# EAGLE design CAN-BUS Shield  v2.0 (EAGLE 6.4)
DESCRIPTION: microOBD 200 OBD-II Module; HW_REV: 1.4; PCB_REV: C; PCB_SPEC1: Layer Count: 4; PCB_SPEC2: Size: 1.3" x 0.59"; PCB_SPEC3: Finish Thickness: 0.049" - 0.052"; PCB_SPEC4: Copper Weight: 1oz; TITLE: STM1120

## Sheet 1 of 2
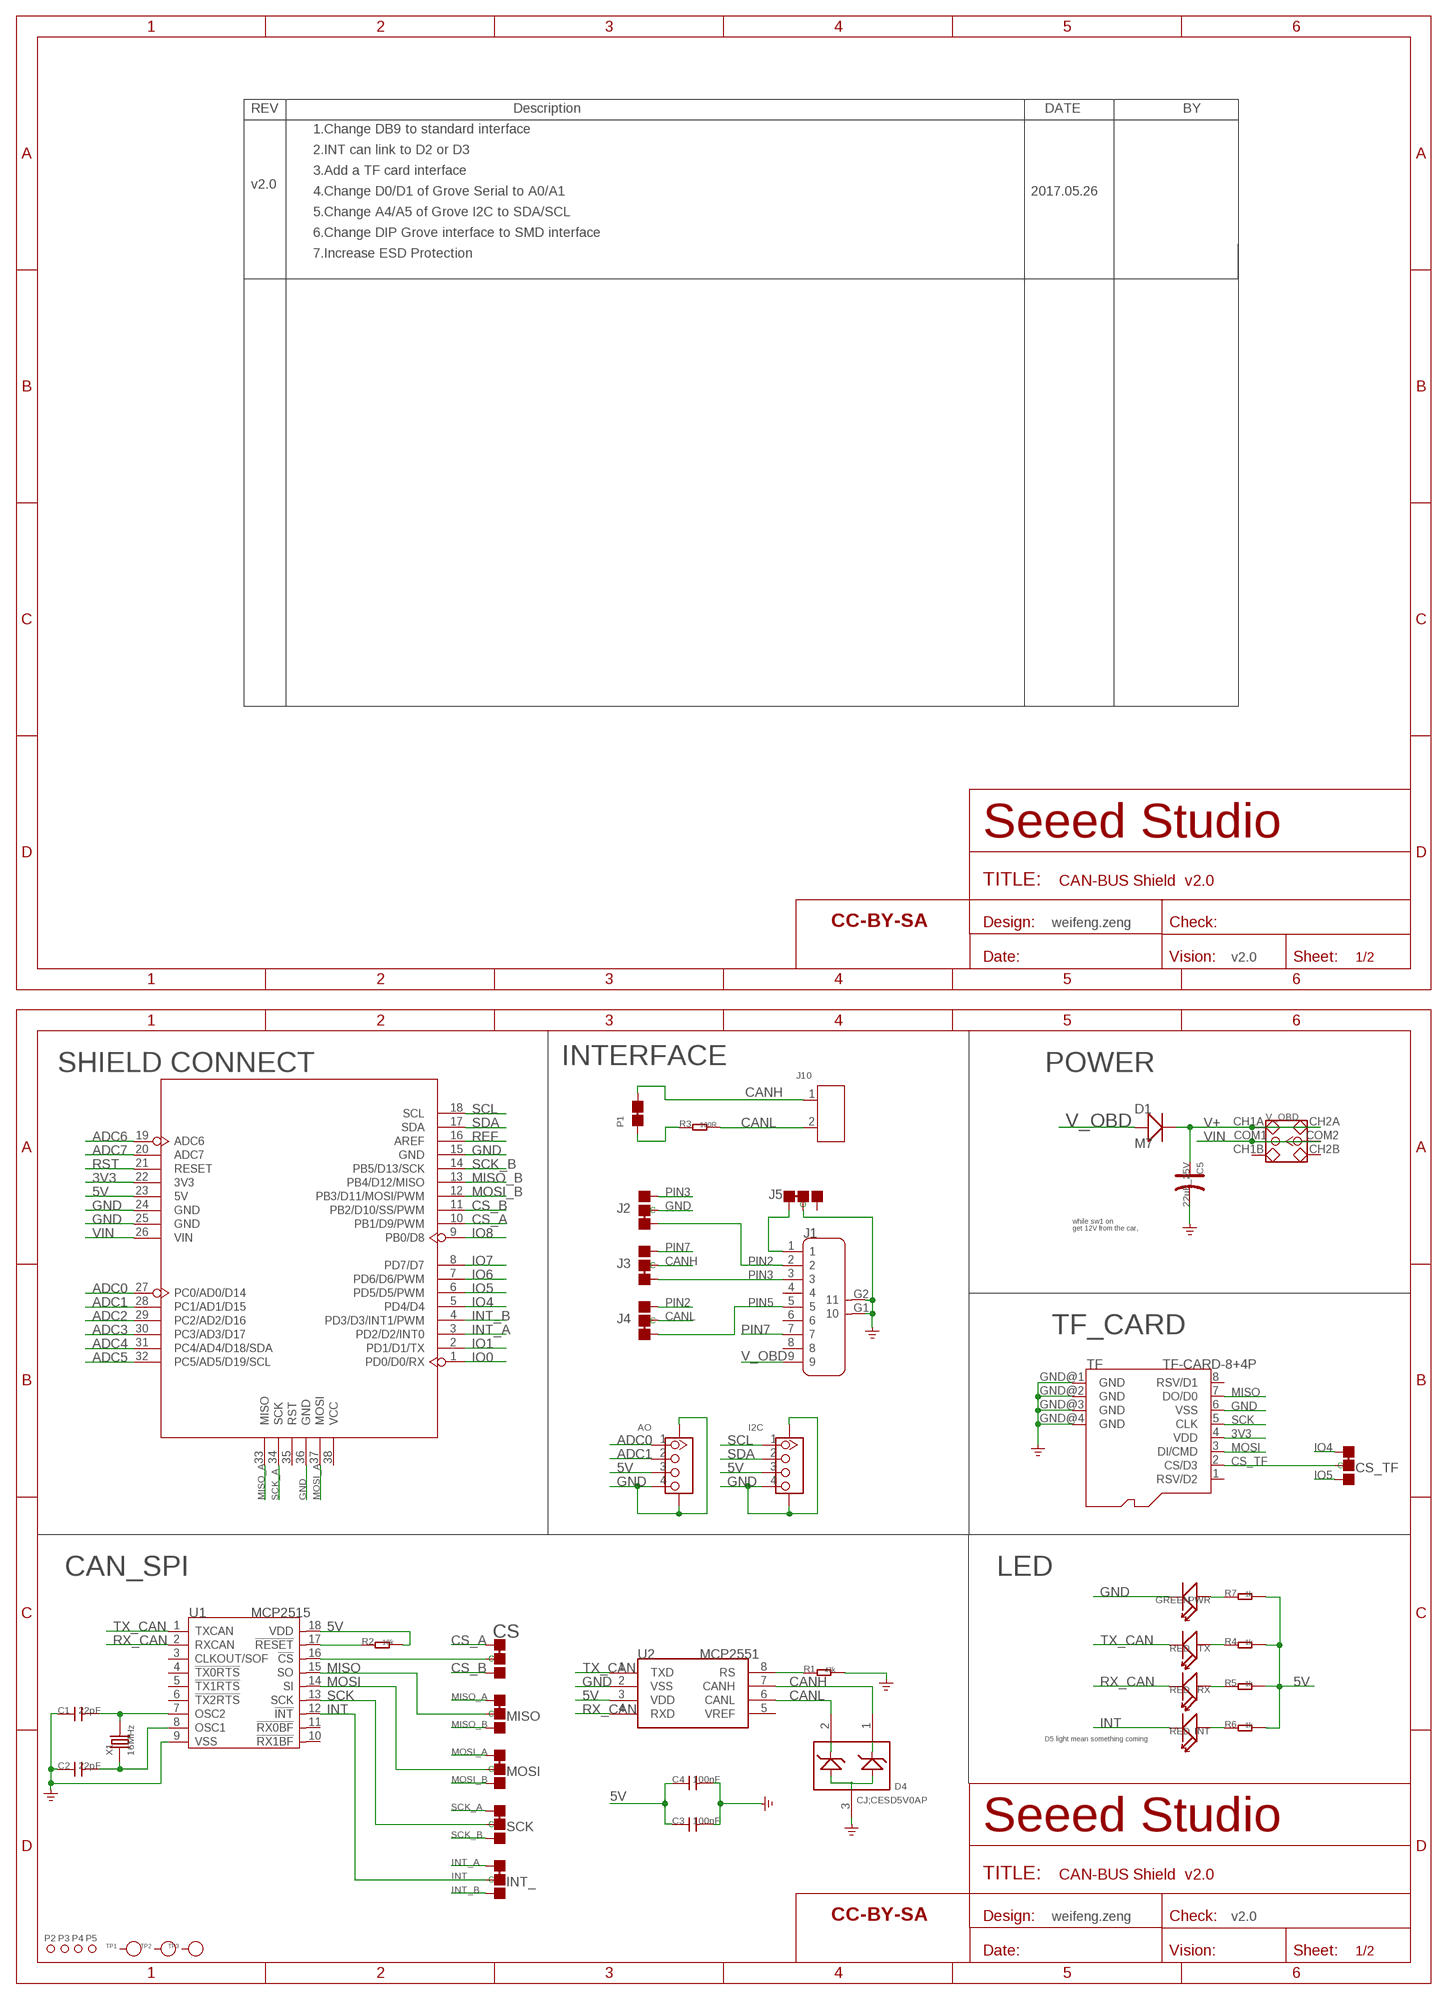
[diagram p0: schematic, sheet 1]

### Parts
AO  GROVE-CONNECTOR-SMD'90D'  [HW4-SMD-2.0-90D]
C1  22pF  C-0603  [0603]
C2  22pF  C-0603  [0603]
C3  100nF  C-0603  [0603]
C4  100nF  C-0603  [0603]
C5  22uF_25V  CAP-ELECTRO-B  [ELECTRO-SMD-B-4.8MM]
CS  JUMPER-3P-SHORT  [3P-SMD-SHORT]
CS_TF  JUMPER-3P-SHORT  [3P-SMD-SHORT]
D1  M7  D-SMA  [D2010]
D4  CJ;CESD5V0AP  D-ESD-3P'CESD3V3AP'  [SOT-23]
I2C  GROVE-CONNECTOR-SMD'90D'  [HW4-SMD-2.0-90D]
INT  RED  LED'0603'  [LED-0603]
INT_  JUMPER-3P-SHORT  [3P-SMD-SHORT]
J1  DB9'MEAL'  [DB9-MEAL]
J2  JUMPER-3P-SHORT  [3P-SMD-SHORT]
J3  JUMPER-3P-SHORT  [3P-SMD-SHORT]
J4  JUMPER-3P-SHORT  [3P-SMD-SHORT]
J5  JUMPER-3P-SHORT  [3P-SMD-SHORT]
J10  SCREW-TERMINAL-2P-10.6X10  [H2-5.0-10.6X10X14.8H]
MISO  JUMPER-3P-SHORT  [3P-SMD-SHORT]
MOSI  JUMPER-3P-SHORT  [3P-SMD-SHORT]
P1  JUMPER-2P-SHORT  [2P-SMD-SHORT]
P2  PAD-MARK'ANNULAR'  [ROUND-MARK-1.0]
P3  PAD-MARK'ANNULAR'  [ROUND-MARK-1.0]
P4  PAD-MARK'ANNULAR'  [ROUND-MARK-1.0]
P5  PAD-MARK'ANNULAR'  [ROUND-MARK-1.0]
PWR  GREEN  LED'0603'  [LED-0603]
R1  47k  R-0603  [0603]
R2  10k  R-0603  [0603]
R3  120R  R-0603  [0603]
R4  1k  R-0603  [0603]
R5  1k  R-0603  [0603]
R6  1k  R-0603  [0603]
R7  1k  R-0603  [0603]
RX  RED  LED'0603'  [LED-0603]
SCK  JUMPER-3P-SHORT  [3P-SMD-SHORT]
TF  TF-CARD-8+4P  [TF-8+4P-1.1-13.5X15MM]
TP1  PAD-TEST-POINT'4545'  [TP_4545]
TP2  PAD-TEST-POINT'4545'  [TP_4545]
TP3  PAD-TEST-POINT'4545'  [TP_4545]
TX  RED  LED'0603'  [LED-0603]
U1  MCP2515  MCP2515-SOIC18  [SOIC18]
U2  MCP2551  MCP2551-SOIC8  [SOIC8-6.0]
U4  ARDUINO-38P'WITH/-SILK'  [ARDUINO-38P-WITH/-SILK-500519002]
U$5  SEEEDSTUDIO-OPEN-SCH-FRAME  [SEEEDSTUDIO-PCB-FRAME]
U$7  SEEEDSTUDIO-OPEN-SCH-FRAME  [SEEEDSTUDIO-PCB-FRAME]
V_OBD  SWITCH-2CH-6P  [6P-2CH-2.54-7.6X3.0]
X1  16MHz  CRYSTAL-HC49S  [HC49/S]

### Nets
3V3: TF.4(VDD) U4.22(3V3)
5V: AO.3 C3.1 C4.1 I2C.3 R2.2 R4.2 R5.2 R6.2 R7.2 U1.18(VDD) U2.3(VDD) U4.23(5V)
ADC0: AO.1 U4.27(PC0/AD0/D14)
ADC1: AO.2 U4.28(PC1/AD1/D15)
ADC2: U4.29(PC2/AD2/D16)
ADC3: U4.30(PC3/AD3/D17)
ADC4: U4.31(PC4/AD4/D18/SDA)
ADC5: U4.32(PC5/AD5/D19/SCL)
ADC6: U4.19(ADC6)
ADC7: U4.20(ADC7)
CANH: D4.1 J3.MM(C) J10.1 P1.2 U2.7(CANH)
CANL: D4.2 J4.MM(C) J10.2 R3.2 U2.6(CANL)
CS_A: CS.11(L) U4.10(PB1/D9/PWM)
CS_B: CS.00(R) U4.11(PB2/D10/SS/PWM)
CS_TF: CS_TF.MM(C) TF.2(CS/D3)
GND: AO.4 AO.SS1 AO.SS2 C1.1 C2.1 C3.2 C4.2 C5.- D4.3 I2C.4 I2C.SS1 I2C.SS2 J1.G1 J1.G2 J2.MM(C) J5.MM(C) PWR.- R1.2 TF.6(VSS) TF.GND@1(GND) TF.GND@2(GND) TF.GND@3(GND) TF.GND@4(GND) U1.9(VSS) U2.2(VSS) U4.15(GND) U4.24(GND) U4.25(GND) U4.36(GND) ; supply symbol labelled GND_POWER
INT: INT.- INT_.MM(C) U1.12(!INT)
INT_A: INT_.11(L) U4.3(PD2/D2/INT0)
INT_B: INT_.00(R) U4.4(PD3/D3/INT1/PWM)
IO0: U4.1(PD0/D0/RX)
IO1: U4.2(PD1/D1/TX)
IO4: CS_TF.11(L) U4.5(PD4/D4)
IO5: CS_TF.00(R) U4.6(PD5/D5/PWM)
IO6: U4.7(PD6/D6/PWM)
IO7: U4.8(PD7/D7)
IO8: U4.9(PB0/D8)
MISO: MISO.MM(C) TF.7(DO/D0) U1.15(SO)
MISO_A: MISO.11(L) U4.33(MISO)
MISO_B: MISO.00(R) U4.13(PB4/D12/MISO)
MOSI: MOSI.MM(C) TF.3(DI/CMD) U1.14(SI)
MOSI_A: MOSI.11(L) U4.37(MOSI)
MOSI_B: MOSI.00(R) U4.12(PB3/D11/MOSI/PWM)
N$1: PWR.+ R7.1
N$2: R4.1 TX.+
N$3: P1.1 R3.1
N$4: J1.1 J5.11(L)
N$13: CS.MM(C) U1.16(!CS)
N$15: R5.1 RX.+
N$16: C1.2 U1.7(OSC2) X1.2
N$17: C2.2 U1.8(OSC1) X1.1
N$19: INT.+ R6.1
N$20: R1.1 U2.8(RS)
PIN2: J1.2 J2.11(L) J4.00(R)
PIN3: J1.3 J2.00(R) J3.11(L)
PIN5: J1.5 J4.11(L)
PIN7: J1.7 J3.00(R)
REF: U4.16(AREF)
RST: U4.21(RESET)
RST_N: R2.1 U1.17(!RESET)
RX_CAN: RX.- U1.2(RXCAN) U2.4(RXD)
SCK: SCK.MM(C) TF.5(CLK) U1.13(SCK)
SCK_A: SCK.11(L) U4.34(SCK)
SCK_B: SCK.00(R) U4.14(PB5/D13/SCK)
SCL: I2C.1 U4.18(SCL)
SDA: I2C.2 U4.17(SDA)
TX_CAN: TX.- U1.1(TXCAN) U2.1(TXD)
V+: C5.+ D1.- V_OBD.CH1A V_OBD.CH2A
V_OBD: D1.+ J1.9
VIN: U4.26(VIN) V_OBD.COM1 V_OBD.COM2
Unconnected: J1.4 J1.6 J1.8 J5.00(R) TF.1(RSV/D2) TF.8(RSV/D1) TP1.T TP2.T TP3.T U1.3(CLKOUT/SOF) U1.4(!TX0RTS) U1.5(!TX1RTS) U1.6(!TX2RTS) U1.10(!RX1BF) U1.11(!RX0BF) U2.5(VREF) U4.35(RST) U4.38(VCC) V_OBD.CH1B V_OBD.CH2B

### Notes on the sheet
- 1.Change DB9 to standard interface
- 2.INT can link to D2 or D3
- 3.Add a TF card interface
- v2.0
- 4.Change D0/D1 of Grove Serial to A0/A1 | 2017.05.26
- 5.Change A4/A5 of Grove I2C to SDA/SCL
- 6.Change DIP Grove interface to SMD interface
- 7.Increase ESD Protection
- weifeng.zeng
- v2.0
- SHIELD CONNECT | INTERFACE | POWER
- while sw1 on
- get 12V from the car,
- TF_CARD
- CAN_SPI | LED
- D5 light mean something coming
- weifeng.zeng | v2.0

## Sheet 2 of 2

## Library data of the parts
AO I2C = Connector-new:GROVE-CONNECTOR-SMD: 4P-SMD-2.0:320110030;4P-SMD-2.0-90D:320110032
C1-C4 = Discrete:C*: Ceramic Capacitors
C5 = Discrete:CAP*: Electrolytic Capacitors,Tantalum Capacitors and Super Capacitors
CS CS_TF INT_ J2-J5 MISO MOSI SCK = Discrete-new:JUMPER-3P-SHORT
D1 = Discrete:D*
D4 = Discrete-new:D-ESD-3P: 304060003
INT PWR RX TX = Discrete:LED*
J1 = Connector:DB9
J10 = Connector-new:SCREW-TERMINAL-2P: 2P-3.5:320110028;2P-5.0:320110031
P1 = Discrete-new:JUMPER-2P-SHORT
P2-P5 = Discrete-new:PAD-MARK; PARTNO: DNP
R1-R7 = Discrete:R*
TF = Connector-new:TF-CARD-8+4P: http://garden.seeedstudio.com/images/e/e4/Flip_TF_Holder.jpg
TP1-TP3 = Discrete:PAD-TEST-POINT; PARTNO: DNP
U1 = IC:MCP2515: Stand-Alone CAN Controller With SPI Interface
U2 = IC:MCP2551: High-Speed CAN Transceiver http://ww1.microchip.com/downloads/en/devicedoc/21667f.pdf
U4 = moudle:ARDUINO-38P
U$5 U$7 = moudle-new:SEEEDSTUDIO-OPEN-SCH-FRAME
V_OBD = Discrete:SWITCH-2CH-6P
X1 = Discrete:CRYSTAL*: CRYSTAL

## Net classes
0 default: width 0.152 mm, drill 0.254 mm, clearance 0.152 mm

## Board
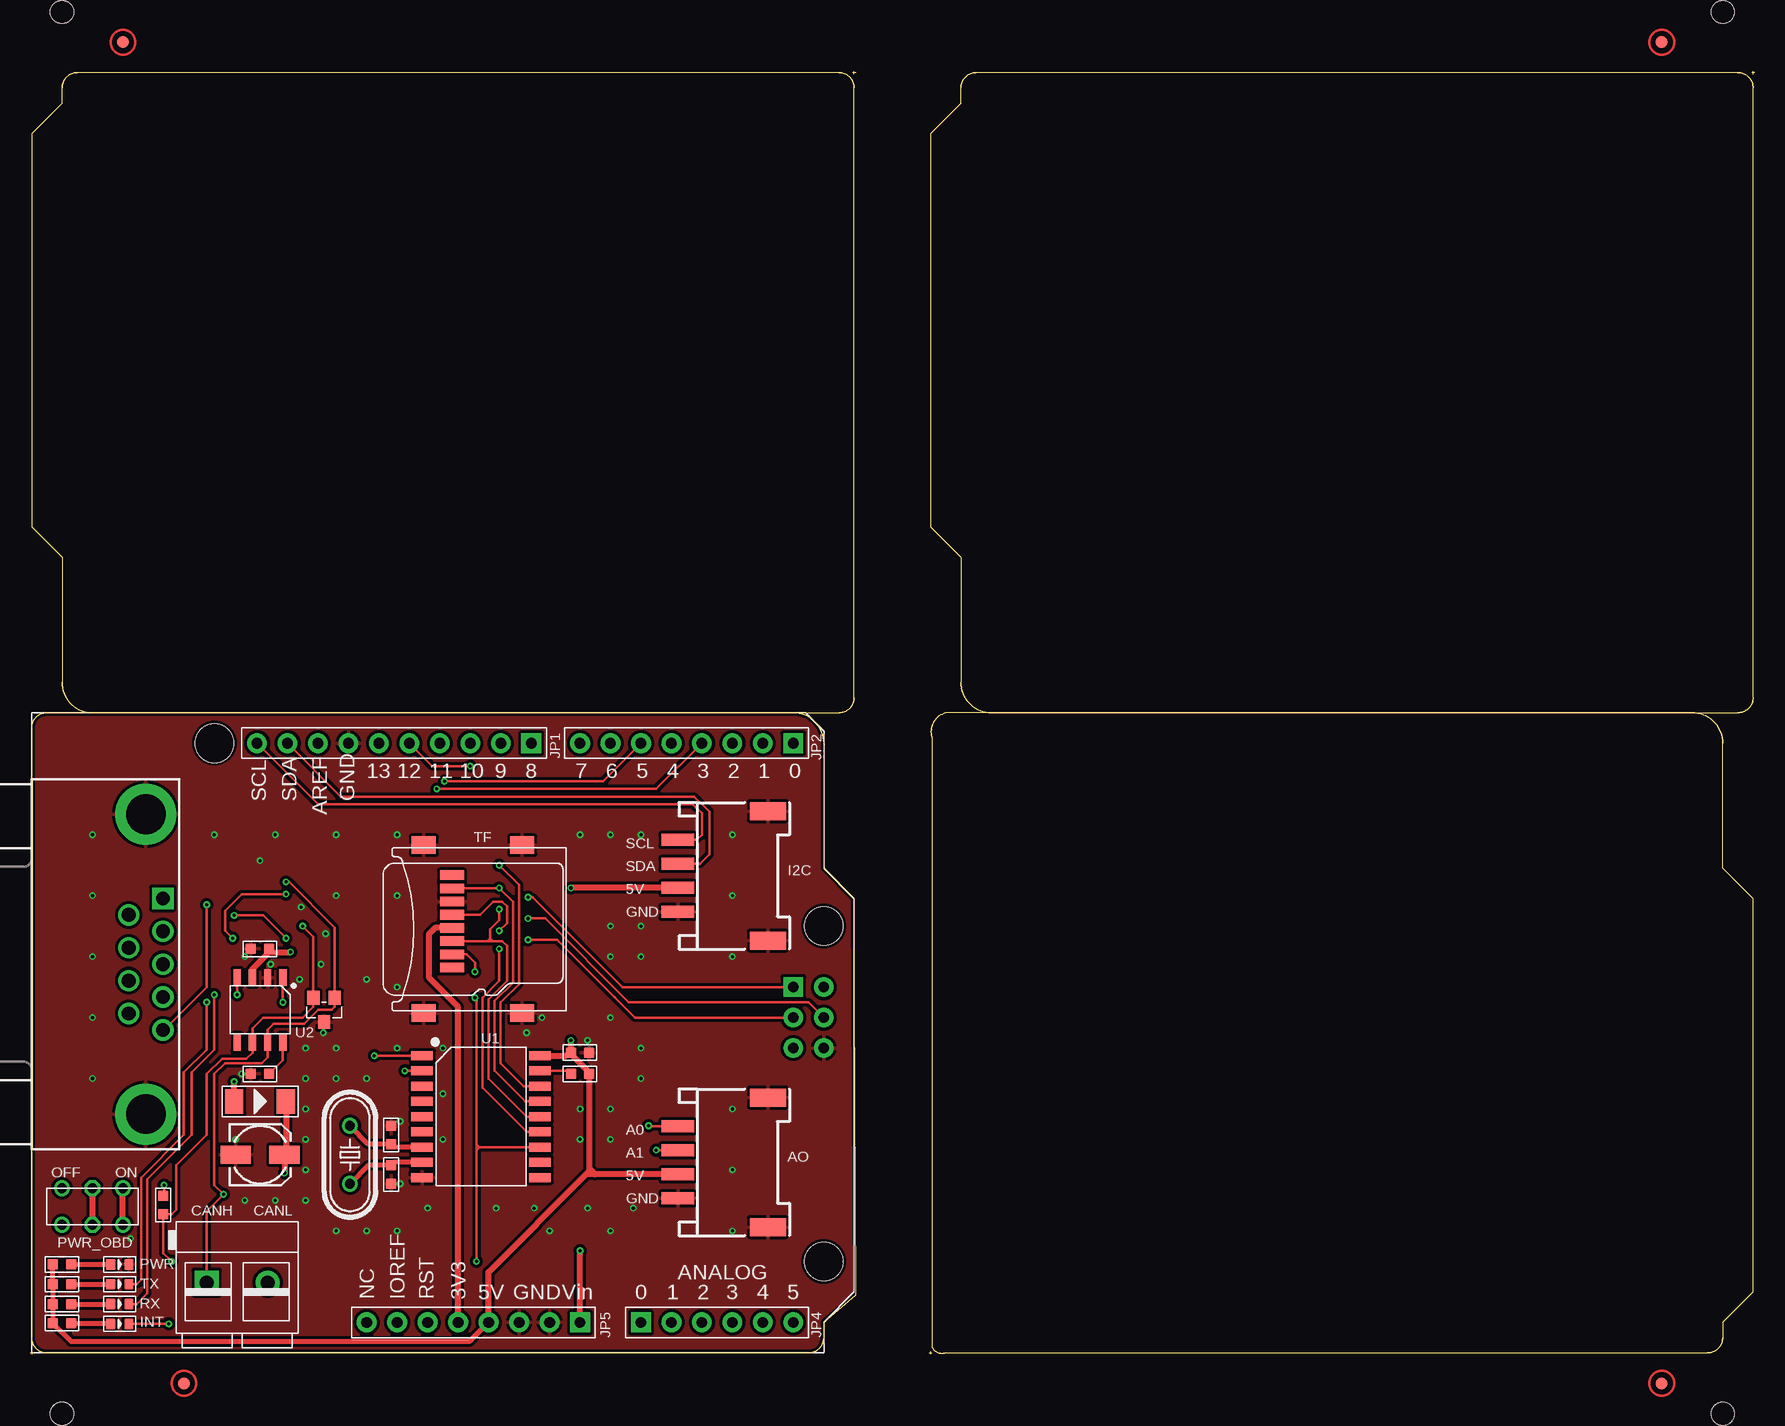
[diagram p1: board, top side]
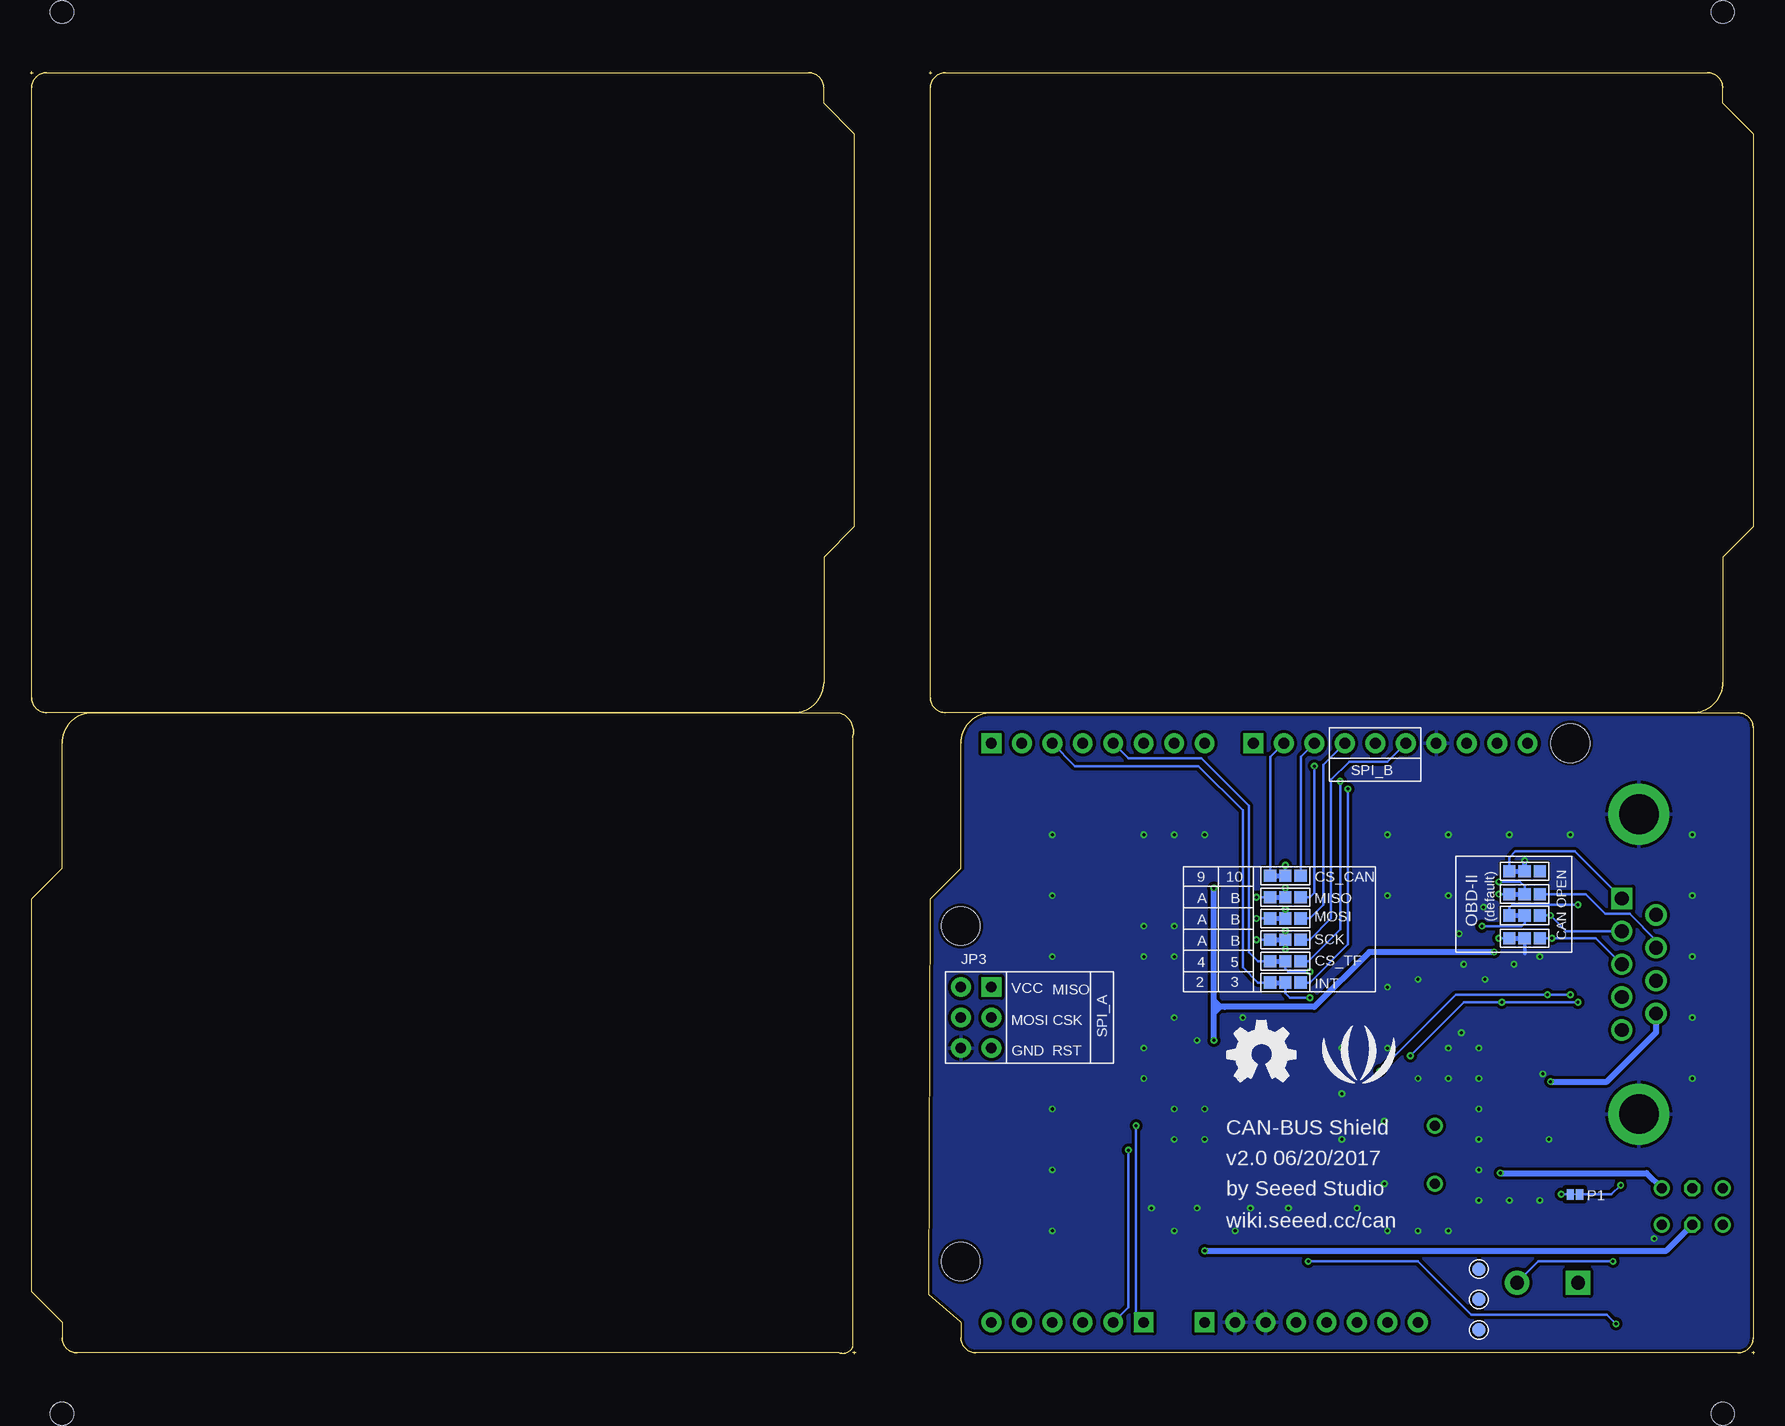
[diagram p2: board, bottom side, seen from below]

Size 143.76 x 106.93 mm. Coordinates in mm from the lower left corner, seen from the top.
Outline: 66.17,1.4 arc-90 64.9,0.13
Outline: 1.4,0.13 arc-90 0.13,1.4
Outline: 0.13,52.2 arc-90 1.4,53.47
Outline: 63.63,53.47 arc-90 66.17,50.93
Outline: 0.13,1.4 arc90 1.4,0.13
Outline: 64.9,0.13 arc90 66.17,1.4
Outline: 1.4,53.47 arc90 0.13,52.2
Outline: 0.13,1.4 arc90 1.4,0.13
Outline: 64.9,0.13 arc90 66.17,1.4
Outline: 66.17,50.93 arc90 63.63,53.47
Outline: 66.17,1.4 66.17,2.67 68.83,4.95 68.71,37.97 66.17,40.51 66.17,50.93
Outline: 66.17,1.4 arc-90 64.9,0.13
Outline: 63.63,53.47 1.4,53.47
Outline: 1.4,53.47 arc90 0.13,52.2
Outline: 0.13,52.2 0.13,1.4
Outline: 0.13,1.4 arc90 1.4,0.13
Outline: 66.17,50.93 arc90 63.63,53.47
Outline: 1.4,0.13 64.9,0.13
Outline: 0,0.13 0.25,0.13
Outline: 0.13,0.25 0.13,0
Outline: 141.1,1.4 arc-90 139.83,0.13
Outline: 76.33,0.13 arc-90 75.18,0.64
Outline: 75.18,51.44 arc-90 76.33,53.47
Outline: 138.56,53.47 arc-90 141.1,50.93
Outline: 75.18,0.64 arc90 76.33,0.13
Outline: 139.83,0.13 arc90 141.1,1.4
Outline: 76.33,53.47 arc90 75.18,51.44
Outline: 75.18,0.64 arc90 76.33,0.13
Outline: 139.83,0.13 arc90 141.1,1.4
Outline: 141.1,50.93 arc90 138.56,53.47
Outline: 141.1,1.4 141.1,2.67 143.64,5.21 143.64,37.97 141.1,40.51 141.1,50.93
Outline: 141.1,1.4 arc-90 139.83,0.13
Outline: 138.56,53.47 76.33,53.47
Outline: 76.33,53.47 arc90 75.18,51.44
Outline: 75.18,51.44 75.18,0.64
Outline: 75.18,0.64 arc90 76.33,0.13
Outline: 141.1,50.93 arc90 138.56,53.47
Outline: 76.33,0.13 139.83,0.13
Outline: 74.93,0.13 75.18,0.13
Outline: 75.06,0.25 75.06,0
Outline: 2.67,105.54 arc-90 3.94,106.81
Outline: 67.44,106.81 arc-90 68.71,105.54
Outline: 68.71,54.74 arc-90 67.44,53.47
Outline: 5.21,53.47 arc-90 2.67,56.01
Outline: 68.71,105.54 arc90 67.44,106.81
Outline: 3.94,106.81 arc90 2.67,105.54
Outline: 67.44,53.47 arc90 68.71,54.74
Outline: 68.71,105.54 arc90 67.44,106.81
Outline: 3.94,106.81 arc90 2.67,105.54
Outline: 2.67,56.01 arc90 5.21,53.47
Outline: 2.67,105.54 2.67,104.27 0.13,101.73 0.13,68.96 2.67,66.42 2.67,56.01
Outline: 2.67,105.54 arc-90 3.94,106.81
Outline: 5.21,53.47 67.44,53.47
Outline: 67.44,53.47 arc90 68.71,54.74
Outline: 68.71,54.74 68.71,105.54
Outline: 68.71,105.54 arc90 67.44,106.81
Outline: 2.67,56.01 arc90 5.21,53.47
Outline: 67.44,106.81 3.94,106.81
Outline: 68.83,106.81 68.58,106.81
Outline: 68.71,106.68 68.71,106.93
Outline: 77.6,105.54 arc-90 78.87,106.81
Outline: 142.37,106.81 arc-90 143.64,105.54
Outline: 143.64,54.74 arc-90 142.37,53.47
Outline: 80.14,53.47 arc-90 77.6,56.01
Outline: 143.64,105.54 arc90 142.37,106.81
Outline: 78.87,106.81 arc90 77.6,105.54
Outline: 142.37,53.47 arc90 143.64,54.74
Outline: 143.64,105.54 arc90 142.37,106.81
Outline: 78.87,106.81 arc90 77.6,105.54
Outline: 77.6,56.01 arc90 80.14,53.47
Outline: 77.6,105.54 77.6,104.27 75.06,101.73 75.06,68.96 77.6,66.42 77.6,56.01
Outline: 77.6,105.54 arc-90 78.87,106.81
Outline: 80.14,53.47 142.37,53.47
Outline: 142.37,53.47 arc90 143.64,54.74
Outline: 143.64,54.74 143.64,105.54
Outline: 143.64,105.54 arc90 142.37,106.81
Outline: 77.6,56.01 arc90 80.14,53.47
Outline: 142.37,106.81 78.87,106.81
Outline: 143.76,106.81 143.51,106.81
Outline: 143.64,106.68 143.64,106.93
Copper layers (1*16): Top 0.035mm / dielectric 1.5mm / Bottom 0.035mm
Design rules "SeeedStudio_2layer_DRU_no_angle_20140221 *": minimum track width 6mil, minimum drill 10mil, track to track 6mil, track to pad 6mil, pad to pad 6mil, via to via 6mil, smd to smd 0mil, copper to edge 10mil, drill to drill 10mil, minimum pad ring 10mil, minimum via ring 6mil, stop-mask expansion 2mil, vias tented up to drill 25mil, thermal gap 10mil
Holes 1.91 mm at 2.67,-4.95 141.1,-4.95 141.1,111.89 2.67,111.89

### Footprints (pad centres in the part's own frame; a part is rotated, then mirrored left to right if it is on the bottom)
HW4-SMD-2.0-90D = smd 1.01 x 2.74: 1 -3,-0.1; 2 -1,-0.1; 3 1,-0.1; 4 3,-0.1 | smd 1.5 x 3: SS1 -5.4,7.4; SS2 5.4,7.4
0603 = smd 0.889 x 0.889: 1 -0.762,0; 2 0.762,0
ELECTRO-SMD-B-4.8MM = smd 2.54 x 1.524: + 2.032,0; - -2.032,0
3P-SMD-SHORT = smd 1.016 x 1.016: 00 -1.27,0; 11 1.27,0; MM 0,0
D2010 = smd 1.524 x 2.032: + -2.159,0; - 2.159,0
SOT-23 = smd 1.016 x 1.143: 1 -0.889,-1.016; 2 0.889,-1.016; 3 0,1.016
LED-0603 = smd 0.762 x 0.889: + -0.762,0; - 0.762,0
DB9-MEAL = drill 1.143 pad 1.778 square: 1 -5.486,1.422 | drill 1.143 pad 1.778: 2 -2.743,1.422; 3 0,1.422; 4 2.743,1.422; 5 5.486,1.422; 6 -4.115,-1.422; 7 -1.372,-1.422; 8 1.372,-1.422; 9 4.115,-1.422 | drill 3.302 pad 5.08: G1 12.497,0; G2 -12.497,0
H2-5.0-10.6X10X14.8H = drill 1.143 pad 2.032 square: 1 -2.54,-0.508 | drill 1.143 pad 2.032: 2 2.54,-0.508
2P-SMD-SHORT = smd 0.889 x 0.61: 1 0,0.381; 2 0,-0.381
ROUND-MARK-1.0 = smd 1.016 x 1.016: P$1 0,0
TF-8+4P-1.1-13.5X15MM = smd 0.8 x 2: 1 3.2,0.25; 2 2.1,0.25; 3 1,0.25; 4 -0.1,0.25; 5 -1.2,0.25; 6 -2.3,0.25; 7 -3.4,0.25; 8 -4.5,0.25 | smd 1.45 x 2: GND@1 -7,6.1; GND@2 -7,-2.1; GND@3 7,-2.1; GND@4 7,6.1
TP_4545 = smd 1.143 x 1.143: T 0,0
SOIC18 = smd 0.762 x 1.778: 1 -5.08,-4.915; 2 -3.81,-4.915; 3 -2.54,-4.915; 4 -1.27,-4.915; 5 0,-4.915; 6 1.27,-4.915; 7 2.54,-4.915; 8 3.81,-4.915; 9 5.08,-4.915; 10 5.08,4.915; 11 3.81,4.915; 12 2.54,4.915; 13 1.27,4.915; 14 0,4.915; 15 -1.27,4.915; 16 -2.54,4.915; 17 -3.81,4.915; 18 -5.08,4.915
SOIC8-6.0 = smd 0.6 x 1.4: 1 -1.905,-2.7; 2 -0.635,-2.7; 3 0.635,-2.7; 4 1.905,-2.7; 5 1.905,2.7; 6 0.635,2.7; 7 -0.635,2.7; 8 -1.905,2.7
ARDUINO-38P-WITH/-SILK-500519002 = drill 0.889 pad 1.651 square: 1 63.5,50.8; 9 41.656,50.8; 26 45.72,2.54; 27 50.8,2.54; 33 63.5,30.48 | drill 0.889 pad 1.651: 2 60.96,50.8; 3 58.42,50.8; 4 55.88,50.8; 5 53.34,50.8; 6 50.8,50.8; 7 48.26,50.8; 8 45.72,50.8; 10 39.116,50.8; 11 36.576,50.8; 12 34.036,50.8; 13 31.496,50.8; 14 28.956,50.8; 15 26.416,50.8; 16 23.876,50.8; 17 21.336,50.8; 18 18.796,50.8; 19 27.94,2.54; 20 30.48,2.54; 21 33.02,2.54; 22 35.56,2.54; 23 38.1,2.54; 24 40.64,2.54; 25 43.18,2.54; 28 53.34,2.54; 29 55.88,2.54; 30 58.42,2.54; 31 60.96,2.54; 32 63.5,2.54; 34 63.5,27.94; 35 63.5,25.4; 36 66.04,25.4; 37 66.04,27.94; 38 66.04,30.48 | hole 3.2: 15.24,50.8; 66.04,35.56; 66.04,7.62
6P-2CH-2.54-7.6X3.0 = drill 0.813 pad 1.27: CH1A -1.524,2.54; CH1B -1.524,-2.54; CH2A 1.524,2.54; CH2B 1.524,-2.54 | drill 0.813 pad 1.27 octagon: COM1 -1.524,0; COM2 1.524,0
HC49/S = drill 0.813: 1 -2.413,0; 2 2.413,0

### Placement (x,y rotation side)
AO  54.1,16 270 top
C1  30.1,18.29 270 top
C2  30.1,14.99 90 top
C3  45.85,25.15 0 top
C4  19.18,33.78 180 top
C5  19.18,16.64 0 top
CS  39.12,39.88 180 bottom
CS_TF  39.12,32.77 180 bottom
D1  19.18,21.08 0 top
D4  24.51,28.7 180 top
I2C  54.1,39.88 270 top
INT  7.49,2.54 0 top
INT_  39.12,30.99 180 bottom
J1  9.65,32.51 270 top
J2  19.18,34.67 180 bottom
J3  19.18,38.35 180 bottom
J4  19.18,36.58 180 bottom
J5  19.18,40.26 180 bottom
J10  17.27,6.48 0 top
MISO  39.12,38.1 180 bottom
MOSI  39.12,36.32 180 bottom
P1  14.99,13.34 270 bottom
P2  12.83,-2.41 0 top
P3  136.02,109.35 0 top
P4  7.75,109.35 0 top
P5  136.02,-2.41 0 top
PWR  7.49,7.49 0 top
R1  19.18,23.37 180 top
R2  45.85,23.37 0 top
R3  11.11,12.45 270 top
R4  2.67,5.84 180 top
R5  2.67,4.19 180 top
R6  2.67,2.6 180 top
R7  2.67,7.49 180 top
RX  7.49,4.19 0 top
SCK  39.12,34.54 180 bottom
TF  34.93,35.43 270 top
TP1  22.99,7.11 0 bottom
TP2  22.99,4.57 0 bottom
TP3  22.99,2.03 0 bottom
TX  7.49,5.84 0 top
U1  37.59,19.81 270 top
U2  19.18,28.7 180 top
U4  0.13,0.13 0 top
U$1  [LOGO_SILK]  33.02,24.26 0 bottom
U$2  GND_POWER  [OSHW_FILLX200_NOTEXT]  43.94,22.73 0 bottom
U$5  18.83,-28.58 0 top  (outside the outline)
U$7  18.8,-19.43 0 top  (outside the outline)
V_OBD  5.21,12.32 270 top
X1  26.67,16.64 90 top

### Tracks (layer width: path | path; a pad name or v marks a point on that pad's centre or on a via)
3V3
  Top 0.508: U4.22 35.69,28.96 33.27,31.37 33.27,35.05 33.76,35.53 TF.4
5V  (via drill 0.25 pad 0.51)
  Top 0.254: R4.2 1.91,5.71
  Top 0.406: 1.91,5.71 R5.2 R6.2 3.43,1.08 36.64,1.08 U4.23 | R4.2 R7.2
  Top 0.508: 45.09,25.27 C3.1 45.09,25.02 46.61,23.49 R2.2 46.61,15.49 | 45.09,25.27 v45.09,26.16 | I2C.3 45.1,38.88 v45.09,38.86 | U1.18 44.7,24.89 45.09,25.27 | 46.61,15.49 46.61,15.24 46.37,15 | 46.37,15 38.23,6.86 U4.23 | AO.3 47.1,15 | 47.1,15 46.37,15 | 47.1,15 46.61,15.49 | U2.3 18.54,32.13 19.94,33.53 | C4.1 19.94,33.53 | 19.94,33.53 v21.72,33.53
  Bottom 0.508: v45.09,26.16 45.09,28.45 | 45.09,28.45 45.09,28.96 | 45.09,28.96 45.09,29.46 | 45.09,29.46 v45.09,38.86 | v21.72,33.53 32.13,33.53 36.7,28.96 44.2,28.96 44.58,28.96 | 44.58,28.96 45.09,28.96 | 44.58,28.96 45.09,29.46 | 44.58,28.96 45.09,28.45
ADC0  (via drill 0.25 pad 0.51)
  Top 0.203: AO.1 51.61,19 v51.56,19.05
  Bottom 0.203: v51.56,19.05 51.56,3.3 U4.27
ADC1  (via drill 0.25 pad 0.51)
  Top 0.203: AO.2 52.21,17 v52.2,17.02
  Bottom 0.203: v52.2,17.02 52.2,3.94 U4.28
CANH  (via drill 0.25 pad 0.51)
  Top 0.203: v21.34,39.37 21.59,39.37 25.4,35.56 D4.1 25.4,28.96 25.15,28.7 24,28.7 22.86,27.56 20.32,27.56 19.81,27.05 U2.7 19.81,24.77 19.3,24.26 16.26,24.26 15.37,23.37 15.37,14.1 v16.13,13.34 14.73,11.94 J10.1
  Bottom 0.203: J3.MM 19.18,38.99 19.56,39.37 v21.34,39.37 | v16.13,13.34 P1.2
CANL  (via drill 0.25 pad 0.51)
  Top 0.203: v11.81,7.75 11.11,8.45 R3.2 11.81,11.68 12.19,12.07 12.19,15.75 14.73,18.29 14.73,23.37 16,24.64 18.03,24.64 18.54,25.15 U2.6 18.54,27.18 19.43,28.07 22.73,28.07 23.62,28.96 D4.2 23.62,34.8 v22.73,35.69
  Bottom 0.203: v22.73,35.69 19.43,35.69 19.18,35.94 J4.MM | v11.81,7.75 18.03,7.75 J10.2
CS_A
  Bottom 0.203: CS.11 40.39,49.78 U4.10
CS_B
  Bottom 0.203: CS.00 37.85,49.78 U4.11
CS_TF  (via drill 0.25 pad 0.51)
  Top 0.203: TF.2 36.39,33.33 37.08,32.64 v37.08,31.88
  Bottom 0.203: CS_TF.MM 39.12,32.13 38.86,31.88 v37.08,31.88
GND  (via drill 0.25 pad 0.51)
  Bottom 0.305: J2.MM 19.18,33.4
  Bottom 0.406: J5.MM v19.18,41.15
  other vias: 17.91,33.15 20.07,32.51 17.65,23.37 30.86,19.43 30.86,14.22 17.14,17.91 8.38,9.65 46.48,26.16 33.15,12.19 38.86,12.19 42.04,12.19 46.48,12.19 50.29,12.19 41.4,26.8 42.67,28.07 5.21,22.99 5.21,28.07 5.21,33.15 5.21,38.23 5.21,43.31 15.37,43.31 20.45,43.31 25.53,43.31 30.61,43.31 30.61,38.23 25.53,38.23 30.61,30.61 25.53,25.53 22.99,25.53 22.99,17.91 22.99,15.37 22.99,12.83 22.99,20.45 22.99,22.99 25.53,22.99 28.07,22.99 25.53,10.29 28.07,10.29 30.61,10.29 48.39,10.29 43.31,10.29 48.39,17.91 48.39,20.45 50.93,22.99 45.85,20.45 45.85,17.91 48.39,28.07 48.39,33.15 50.93,33.15 48.39,35.69 50.93,35.69 20.45,12.83 17.91,12.83 58.55,10.29 58.55,15.37 58.55,20.45 50.93,25.53 58.55,33.15 58.55,38.23 58.55,43.31 50.93,43.31 48.39,43.31 45.85,43.31 30.61,25.53 34.42,25.53 34.42,21.72 34.42,17.91 24.26,32.51 24.64,35.05 22.61,37.27 24.45,26.8 28.07,31.24 22.48,31.24
  pour Top (isolate 0.254, rank 6): -0.51,54.1 69.34,54.1 69.34,6.98 69.34,-0.51 61.72,-0.51 -0.51,-0.51
  pour Bottom (isolate 0.254, rank 6): -0.51,54.1 69.34,54.1 69.34,6.98 69.34,-0.51 61.72,-0.51 -0.51,-0.51
INT  (via drill 0.25 pad 0.51)
  Top 0.203: v37.08,29.72 37.21,29.59 37.21,17.53 | INT.- v11.56,2.54 | 37.21,17.53 37.21,17.27 | 37.21,17.27 37.21,17.02 | 37.21,17.02 v37.21,7.75 | U1.12 37.59,17.27 37.47,17.27 | 37.47,17.27 37.21,17.02 | 37.47,17.27 37.21,17.53 | 37.47,17.27 37.21,17.27
  Bottom 0.203: INT_.MM 39.12,30.1 38.73,29.72 v37.08,29.72 | v11.56,2.54 12.32,3.3 23.62,3.3 28.07,7.75 v37.21,7.75
INT_A
  Bottom 0.203: INT_.11 41.4,30.99 42.67,32.26 42.67,45.34 46.36,49.02 56.64,49.02 U4.3
INT_B  (via drill 0.25 pad 0.51)
  Top 0.203: v33.91,47.12 52.2,47.12 U4.4
  Bottom 0.203: INT_.00 37.08,30.99 33.91,34.16 v33.91,47.12
IO4
  Bottom 0.203: CS_TF.11 41.4,32.77 42.16,33.53 42.16,45.72 46.1,49.66 52.2,49.66 U4.5
IO5  (via drill 0.25 pad 0.51)
  Top 0.203: v34.54,47.75 47.75,47.75 U4.6
  Bottom 0.203: CS_TF.00 37.21,32.77 34.54,35.43 v34.54,47.75
MISO  (via drill 0.25 pad 0.51)
  Top 0.203: TF.7 39.09,38.83 v39.12,38.86 40.26,37.72 40.26,30.99 38.73,29.46 38.73,23.62 41.28,21.08 U1.15
  Bottom 0.203: MISO.MM v39.12,38.86
MISO_A  (via drill 0.25 pad 0.51)
  Top 0.203: v41.53,38.1 41.91,38.1 49.4,30.61 U4.33
  Bottom 0.203: MISO.11 v41.53,38.1
MISO_B  (via drill 0.25 pad 0.51)
  Top 0.203: v36.7,49.02 33.53,49.02 U4.13
  Bottom 0.203: MISO.00 37.08,38.1 36.7,38.48 v36.7,49.02
MOSI  (via drill 0.25 pad 0.51)
  Top 0.203: U1.14 41.4,19.81 38.23,22.99 38.23,29.59 39.75,31.11 39.75,34.04 39.35,34.43 38.66,34.43 38.59,34.43 | TF.3 38.12,34.43 | 38.12,34.43 38.35,34.43 | 38.35,34.43 38.59,34.43 | v39.12,37.08 39.12,36.2 38.35,35.43 38.35,34.67 | 38.35,34.67 38.35,34.43 | 38.12,34.43 38.35,34.67 | 38.59,34.43 38.35,34.67
  Bottom 0.203: MOSI.MM v39.12,37.08
MOSI_A  (via drill 0.25 pad 0.51)
  Top 0.203: v41.53,36.32 42.93,36.32 49.91,29.34 64.9,29.34 U4.37
  Bottom 0.203: MOSI.11 v41.53,36.32
MOSI_B
  Bottom 0.203: MOSI.00 37.08,36.32 35.94,37.47 35.94,49.15 U4.12
N$1
  Top 0.406: R7.1 PWR.+
N$2
  Top 0.406: R4.1 TX.+
N$3  (via drill 0.25 pad 0.51)
  Top 0.203: v11.18,14.1 11.18,13.27 R3.1
  Bottom 0.203: P1.1 11.94,13.34 v11.18,14.1
N$4
  Bottom 0.203: J1.1 14.99,41.91 19.94,41.91 20.45,41.4 J5.11
N$13  (via drill 0.25 pad 0.51)
  Top 0.203: v39.12,40.77 40.77,39.12 40.77,30.86 39.24,29.34 39.24,24.26 41.15,22.35 U1.16
  Bottom 0.203: CS.MM v39.12,40.77
N$15
  Top 0.406: R5.1 RX.+
N$16
  Top 0.406: U1.7 30.35,17.27 C1.2 28.19,17.53 X1.2
N$17
  Top 0.406: U1.8 30.35,16 C2.2 28.19,15.75 X1.1
N$19
  Top 0.406: R6.1 6.67,2.6 INT.+
N$20
  Top 0.203: U2.8 21.08,24.51 R1.1
PIN2  (via drill 0.25 pad 0.51)
  Top 0.203: v17.02,36.58 19.43,36.58 v21.34,34.67
  Bottom 0.203: J4.00 v17.02,36.58 15.7,35.26 J1.2 | v21.34,34.67 J2.11
PIN3  (via drill 0.25 pad 0.51)
  Top 0.203: v21.34,38.35 17.65,38.35 16.26,36.96 16.26,35.31 v16.89,34.67
  Bottom 0.203: J1.3 13.23,34.67 v16.89,34.67 J2.00 | v21.34,38.35 J3.11
PIN5  (via drill 0.25 pad 0.51)
  Top 0.203: J1.5 11.15,27.03 14.73,30.61 v14.73,37.47
  Bottom 0.203: v14.73,37.47 20.19,37.47 20.45,37.21 J4.11
PIN7
  Bottom 0.203: J3.00 14.1,38.35 12.45,36.7 10.41,36.7 8.23,34.52 J1.7
RST_N
  Top 0.203: U1.17 44.83,23.62 R2.1
RX_CAN  (via drill 0.25 pad 0.51)
  Top 0.203: RX.- 8.89,4.19 9.78,5.08 9.78,14.61 13.46,18.29 13.46,23.49 15.37,25.4 v15.37,29.97 | v31.24,23.62 U1.2 | U2.4 v17.27,29.97
  Bottom 0.203: v15.37,29.97 v17.27,29.97 24.89,29.97 v31.24,23.62
SCK  (via drill 0.25 pad 0.51)
  Top 0.203: U1.13 41.4,18.54 37.72,22.22 37.72,29.72 39.12,31.11 v39.12,33.78 | TF.5 37.52,36.63 38.61,37.72 39.37,37.72 39.75,37.34 39.75,35.94 v39.12,35.31
  Bottom 0.203: v39.12,35.31 SCK.MM v39.12,33.78
SCK_A  (via drill 0.25 pad 0.51)
  Top 0.203: v41.53,34.54 43.94,34.54 48.71,29.78 48.77,29.72 50.42,28.07 U4.34
  Bottom 0.203: SCK.11 v41.53,34.54
SCK_B
  Bottom 0.203: SCK.00 37.08,34.54 35.31,36.32 35.31,47.88 33.78,49.4 30.61,49.4 U4.14
SCL
  Top 0.203: U4.18 24,45.85 55.25,45.85 56.01,45.09 56.01,43.31 55.58,42.88 I2C.1
SDA
  Top 0.203: U4.17 25.91,46.48 55.37,46.48 56.64,45.21 56.64,41.66 55.86,40.88 I2C.2
TX_CAN  (via drill 0.25 pad 0.51)
  Top 0.203: TX.- 8.89,5.84 9.27,6.22 9.27,14.73 12.83,18.29 12.83,23.49 14.73,25.4 v14.73,29.34 | v28.7,24.89 U1.1 | U2.1 v21.08,29.34
  Bottom 0.203: v14.73,29.34 v21.08,29.34 24.26,29.34 v28.7,24.89
V+  (via drill 0.25 pad 0.51)
  Top 0.508: V_OBD.CH2A V_OBD.CH1A | v21.21,15.11 C5.+ 21.34,16.76 D1.-
  Bottom 0.508: v21.21,15.11 9.02,15.11 V_OBD.CH1A
V_OBD  (via drill 0.25 pad 0.51)
  Top 0.508: D1.+ v17.02,22.73
  Bottom 0.508: v17.02,22.73 12.32,22.73 8.57,26.48 8.38,26.67 8.23,26.82 J1.9
VIN  (via drill 0.25 pad 0.51)
  Top 0.508: U4.26 v45.85,8.64 | V_OBD.COM1 V_OBD.COM2
  Bottom 0.508: v45.85,8.64 7.37,8.64 V_OBD.COM2

### Text on the board
tPlace: TF | SCL | SDA | 5V | GND | A0 | A1 | OFF | ON | 5V | GND | CANH | CANL | PWR_OBD
bPlace: SPI_B | CAN OPEN | (default) | OBD-II | CS_CAN | 10 | 9 | B | A | B | A | B | A | 5 | 4 | INT | 3 | 2 | SPI_A | MISO | VCC | CSK | MOSI | RST | GND | CAN-BUS Shield | v2.0 06/20/2017 | by Seeed Studio | wiki.seeed.cc/can